# EAGLE design lm386_nogain_v2 (EAGLE 8.7.1)
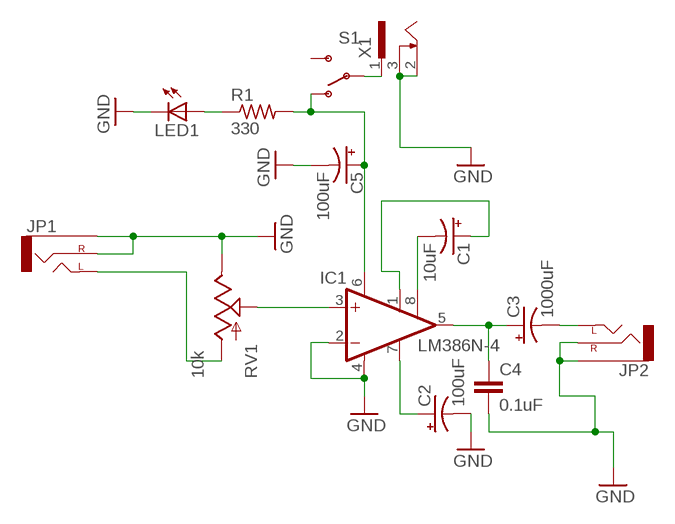
[diagram p0: schematic, sheet 1]

## Parts
C1  10uF  CAP_POLPTH2  [CPOL-RADIAL-10UF-25V]
C2  100uF  CAP_POLPTH2  [CPOL-RADIAL-10UF-25V]
C3  1000uF  CAP_POLPTH2  [CPOL-RADIAL-10UF-25V]
C4  0.1uF  CAPPTH2  [CAP-PTH-SMALL2]
C5  100uF  100UF-25V-20%(PTH)  [CPOL-RADIAL-100UF-25V]
IC1  LM386N-4  [DIL08]
JP1  AUDIO-JACKPTH  [AUDIO-JACK]
JP2  AUDIO-JACKPTH  [AUDIO-JACK]
LED1  LED5MM  [LED5MM]
R1  330  R-US_0204/2V  [0204V]
RV1  10k  POT  [ALPS_POT]
S1  SWITCH-SPDTPTH_LOCK  [SWITCH-SPDT_LOCK.007S]
X1  SCD-014A  [SCD-014-A]

## Nets
GND: C2.2(-) C4.2 C5.2(-) IC1.2(-IN) IC1.4(GND) JP1.RING(RIGHT) JP1.SLEEVE JP2.RING(RIGHT) JP2.SLEEVE LED1.K(C) RV1.P$1(E) X1.2 X1.3
N$1: JP1.TIP(LEFT) RV1.P$3(A)
N$2: IC1.3(+IN) RV1.P$2(S)
N$3: S1.2(P) X1.1
N$4: C5.1(+) IC1.6(VS) R1.2 S1.1(O)
N$5: C1.1(+) IC1.1(GAIN)
N$6: C1.2(-) IC1.8(GAIN)
N$7: C2.1(+) IC1.7(BYPASS)
N$8: C3.1(+) C4.1 IC1.5(OUT)
N$10: LED1.A R1.1
N$11: C3.2(-) JP2.TIP(LEFT)
Unconnected: S1.3(S)

## Library data of the parts
C1-C3 = SparkFun-Passives:CAP_POL: Capacitor Polarized These are standard SMD and PTH capacitors. Normally 10uF, 47uF, and 100uF in electrolytic and tantalum varieties. Always verify the external diameter of the through hole cap, it varies with capacity, voltage, and manufacturer. The EIA devices should be standard.
C4 = SparkFun-Capacitors:CAP: Capacitor Standard 0603 ceramic capacitor, and 0.1" leaded capacitor.
C5 = SparkFun-Capacitors:100UF-25V-20%(PTH): CAP-08439; PROD_ID: CAP-08439
IC1 = linear:LM386?-*: Low Voltage Audio Power Amplifier Source: http://cache.national.com/ds/LM/LM386.pdf
JP1 JP2 = SparkFun-Connectors:AUDIO-JACK: 3.5mm Audio Jack Simple 3.5mm common PCB mount audio jack. Variant PTH is our storefront SKU PRT-08032
LED1 = led:LED: LED OSRAM: - CHIPLED LG R971, LG N971, LY N971, LG Q971, LY Q971, LO R971, LY R971 LH N974, LH R974 LS Q976, LO Q976, LY Q976 LO Q996 - Hyper CHIPLED LW Q18S LB Q993, LB Q99A, LB R99A - SideLED LS A670, LO A670, LY A670, LG A670, LP A670 LB A673, LV A673, LT A673, LW A673 LH A674 LY A675 LS A676, LA A676, LO A676, LY A676, LW A676 LS A679, LY A679, LG A679 - Hyper Micro SIDELED® LS Y876, LA Y876, LO Y876, LY Y876 LT Y87S - SmartLED LW L88C, LW L88S LB L89C, LB L89S, LG L890 LS L89K, LO L89K, LY L89K LS L896, LA L896, LO L896, LY L896 - TOPLED LS T670, LO T670, LY T670, LG T670, LP T670 LSG T670, LSP T670, LSY T670, LOP T670, LYG T670 LG T671, LOG T671, LSG T671 LB T673, LV T673, LT T673, LW T673 LH T674 LS T676, LA T676, LO T676, LY T676, LB T676, LH T676, LSB T676, LW T676 LB T67C, LV T67C, LT T67C, LS T67K, LO T67K, LY T67K, LW E67C LS E67B, LA E67B, LO E67B, LY E67B, LB E67C, LV E67C, LT E67C LW T67C LS T679, LY T679, LG T679 LS T770, LO T770, LY T770, LG T770, LP T770 LB T773, LV T773, LT T773, LW T773 LH T774 LS E675, LA E675, LY E675, LS T675 LS T776, LA T776, LO T776, LY T776, LB T776 LHGB T686 LT T68C, LB T68C - Hyper Mini TOPLED® LB M676 - Mini TOPLED Santana® LG M470 LS M47K, LO M47K, LY M47K Source: http://www.osram.convergy.de LUXEON: - LUMILED® LXK2-PW12-R00, LXK2-PW12-S00, LXK2-PW14-U00, LXK2-PW14-V00 LXK2-PM12-R00, LXK2-PM12-S00, LXK2-PM14-U00 LXK2-PE12-Q00, LXK2-PE12-R00, LXK2-PE12-S00, LXK2-PE14-T00, LXK2-PE14-U00 LXK2-PB12-K00, LXK2-PB12-L00, LXK2-PB12-M00, LXK2-PB14-N00, LXK2-PB14-P00, LXK2-PB14-Q00 LXK2-PR12-L00, LXK2-PR12-M00, LXK2-PR14-Q00, LXK2-PR14-R00 LXK2-PD12-Q00, LXK2-PD12-R00, LXK2-PD12-S00 LXK2-PH12-R00, LXK2-PH12-S00 LXK2-PL12-P00, LXK2-PL12-Q00, LXK2-PL12-R00 Source: www.luxeon.com KINGBRIGHT: KA-3528ASYC Source: www.kingbright.com
R1 = rcl:R-US_: RESISTOR, American symbol; SPICEPREFIX: R
RV1 = SparkFun-Electromechanical:POT; PROD_ID: RES-09177
S1 = SparkFun-Electromechanical:SWITCH-SPDT: SPDT Switch Simple slide switch, Spark Fun Electronics SKU : COM-00102 DPDT SMT slide switch, AYZ0202, SWCH-08179
X1 = con-shiua-chyuan:SCD-014A: Power Jack 2.5mm; OC_FARNELL: unknown; OC_NEWARK: unknown

## Board
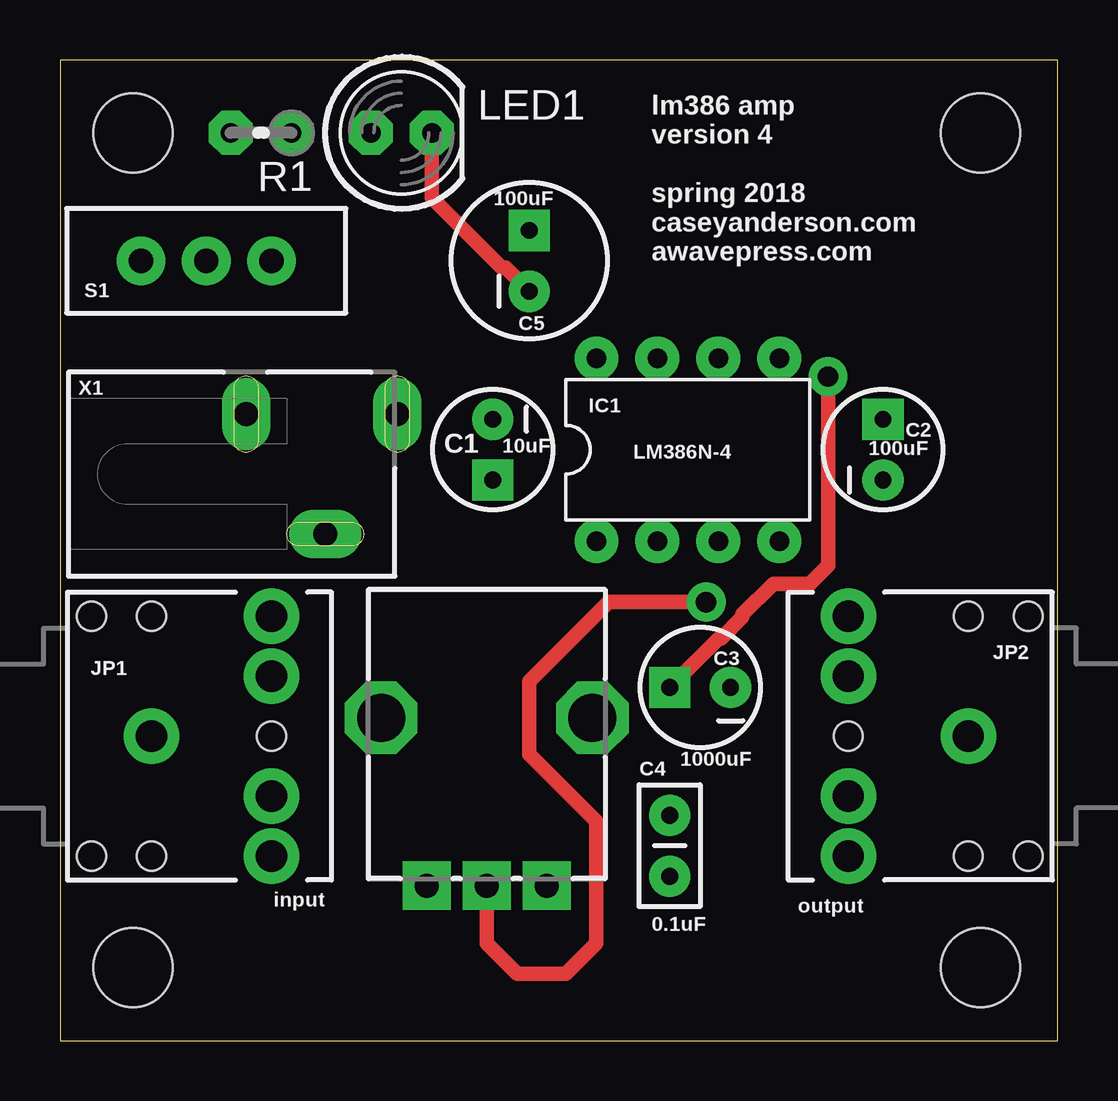
[diagram p1: board, top side]
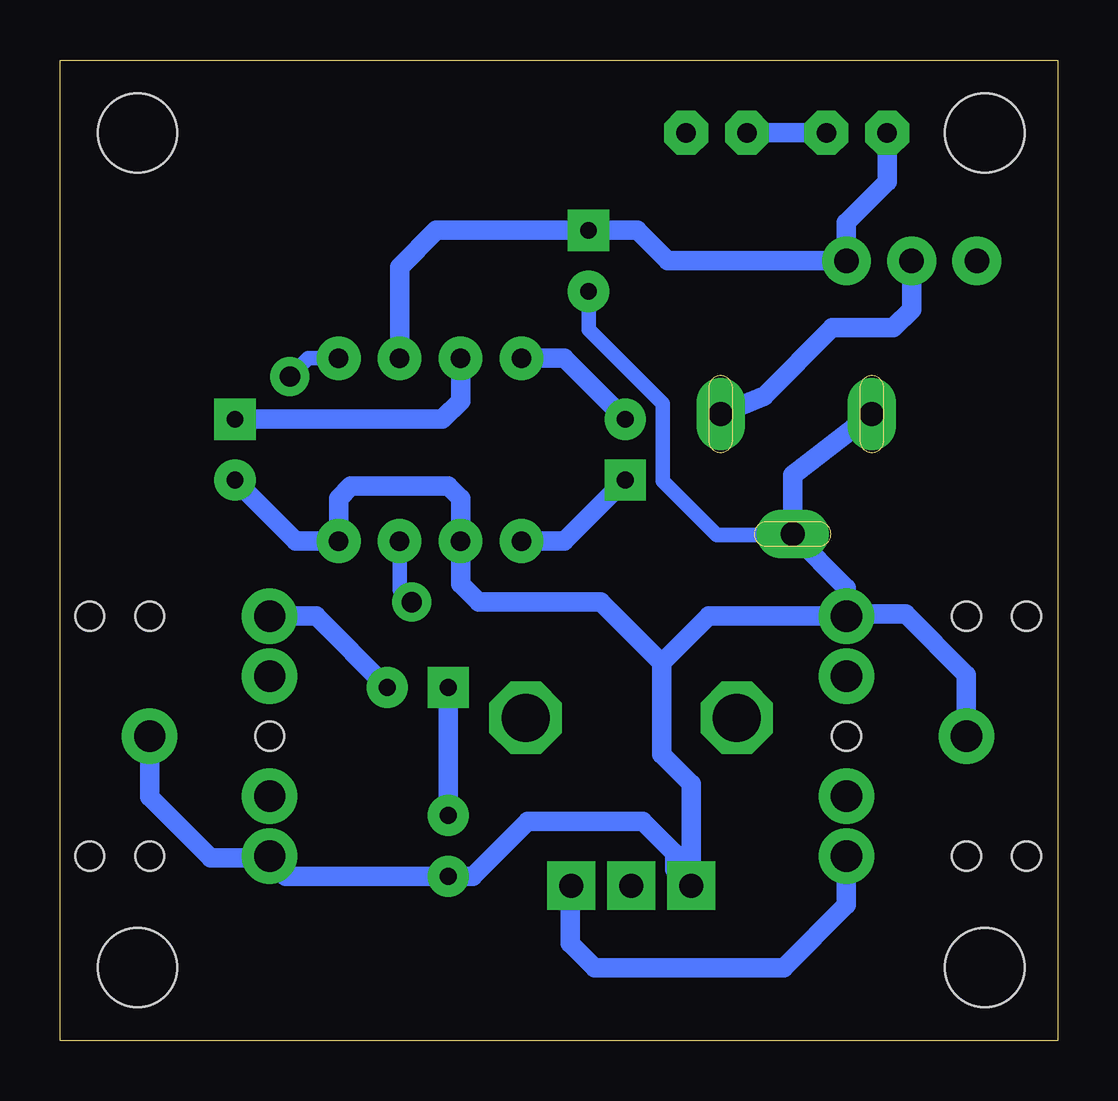
[diagram p2: board, bottom side, seen from below]

Size 41.58 x 40.88 mm. Coordinates in mm from the lower left corner, seen from the top.
Outline: 0,0 41.58,0 41.58,40.88 0,40.88 0,0
Copper layers (1*16): Top 0.035mm / dielectric 1.5mm / Bottom 0.035mm
Design rules "Othermill-DRC-1-64 *": minimum track width 8mil, minimum drill 0.8mm, track to track 0.39878125mm, track to pad 0.39878125mm, pad to pad 0.39878125mm, via to via 0.39878125mm, smd to smd 0mil, copper to edge 0mil, drill to drill 1mil, minimum pad ring 20mil, minimum via ring 15mil, stop-mask expansion 1mil, vias tented up to drill 30mil, thermal gap 10mil

### Footprints (pad centres in the part's own frame; a part is rotated, then mirrored left to right if it is on the bottom)
CPOL-RADIAL-10UF-25V = drill 0.7 pad 1.651 square: 1 1.27,0 | drill 0.7 pad 1.651: 2 -1.27,0
CAP-PTH-SMALL2 = drill 0.7 pad 1.651: 1 0,0; 2 2.54,0
CPOL-RADIAL-100UF-25V = drill 0.7 pad 1.651 square: 1 1.27,0 | drill 0.7 pad 1.651: 2 -1.27,0
DIL08 = drill 0.813 pad 1.27: 1 -3.81,-3.81; 2 -1.27,-3.81; 3 1.27,-3.81; 4 3.81,-3.81; 5 3.81,3.81; 6 1.27,3.81; 7 -1.27,3.81; 8 -3.81,3.81
AUDIO-JACK = drill 1.3 pad 2.184: RING 5,5; RSH 5,2.5; SLEEVE 0,0; TIP 5,-5; TSH 5,-2.5 | hole 1.2: 0,5; -2.5,5; -2.5,-5; 0,-5; 5,0
LED5MM = drill 0.813 octagon: A -1.27,0; K 1.27,0
0204V = drill 0.813 octagon: 1 -1.27,0; 2 1.27,0
ALPS_POT = drill 1 pad 1.88 square: P$1 7,-2.5; P$2 7,0; P$3 7,2.5 | drill 2 octagon: P$4 0,-4.4; P$5 0,4.4
SWITCH-SPDT_LOCK.007S = drill 1.016 pad 1.88: 1 0,2.718; 2 0,0; 3 0,-2.718
STAND-OFF = hole 3.302: 0,0
SCD-014-A = drill 1 pad 2 long: 1 -2.5,13.8; 2 -2.5,7.5; 3 2.5,10.8

### Placement (x,y rotation side)
C1  18.03,24.64 270 top
C2  34.29,24.64 90 top
C3  26.67,14.73 180 top
C4  25.4,9.4 270 top
C5  19.56,32.51 90 top
IC1  26.16,24.64 0 top
JP1  3.81,12.7 0 top
JP2  37.85,12.7 180 top
LED1  14.22,37.85 0 top
R1  8.38,37.85 180 top
RV1  17.78,13.46 270 top
S1  6.1,32.51 270 top
U$1  [STAND-OFF]  3.05,37.85 0 top
U$2  [STAND-OFF]  38.35,37.85 0 top
U$3  [STAND-OFF]  38.35,3.05 0 top
U$4  [STAND-OFF]  3.05,3.05 0 top
X1  0.25,23.62 270 top

### Tracks (layer width: path | path; a pad name or v marks a point on that pad's centre or on a via)
GND
  Top 0.61: C5.2 18.58,32.22 18.41,32.22 15.49,35.13 LED1.K
  Bottom 0.61: C5.2 19.56,29.64 16.47,26.55 16.47,23.33 14.22,21.08 11.09,21.08 X1.3
  Bottom 0.813: JP1.SLEEVE 3.81,15.24 6.35,17.78 8.73,17.78 JP1.RING | X1.2 11.05,23.58 X1.3 8.81,18.88 JP1.RING | 16.51,15.75 16.51,11.94 15.28,10.71 RV1.P$1 15.97,7.15 15.97,7.8 17.31,9.14 22.1,9.14 24.38,6.86 C4.2 32.16,6.86 32.93,7.62 | 16.51,15.75 14.56,17.7 JP1.RING | 16.51,15.75 19.05,18.29 24.13,18.29 24.89,19.05 IC1.2 24.89,22.61 25.4,23.11 29.46,23.11 29.97,22.61 IC1.4 31.75,20.83 C2.2 | JP2.SLEEVE 37.85,10.16 35.31,7.62 32.93,7.62 | 32.93,7.62 JP2.RING
N$1
  Bottom 0.813: JP1.TIP 8.81,5.67 11.43,3.05 19.3,3.05 20.32,4.06 20.32,6.42 RV1.P$3
N$2  (via drill 0.85 pad 1.1)
  Top 0.61: RV1.P$2 17.78,4.06 19.05,2.79 21.08,2.79 22.35,4.06 22.35,9.14 19.56,11.94 19.56,14.99 22.86,18.29 v26.92,18.29
  Bottom 0.61: IC1.3 27.43,18.8 v26.92,18.29
N$3
  Bottom 0.813: X1.1 12.23,26.88 9.4,29.72 6.86,29.72 6.1,30.48 S1.2
N$4
  Bottom 0.813: IC1.6 27.43,32.26 25.91,33.78 C5.1 17.53,33.78 16.26,32.51 S1.1 8.81,34.11 7.11,35.81 R1.2
N$5
  Bottom 0.813: C1.1 20.57,20.83 IC1.1
N$6
  Bottom 0.813: C1.2 20.57,28.45 IC1.8
N$7
  Bottom 0.813: IC1.7 24.89,26.67 25.65,25.91 C2.1
N$8  (via drill 0.85 pad 1.1)
  Top 0.61: v32,27.69 32,19.81 31.24,19.05 29.72,19.05 28.43,17.77 28.43,17.66 27.55,16.78 27.45,16.78 C3.1
  Bottom 0.61: IC1.5 31.24,28.45 v32,27.69
  Bottom 0.813: C3.1 C4.1
N$10
  Bottom 0.813: R1.1 LED1.A
N$11
  Bottom 0.813: C3.2 30.91,17.7 JP2.TIP

### Text on the board
tPlace: lm386 amp / version 4 / / spring 2018 / caseyanderson.com / awavepress.com | input | output